# Altium schematic sheet joystickClocks.SchDoc
size A4
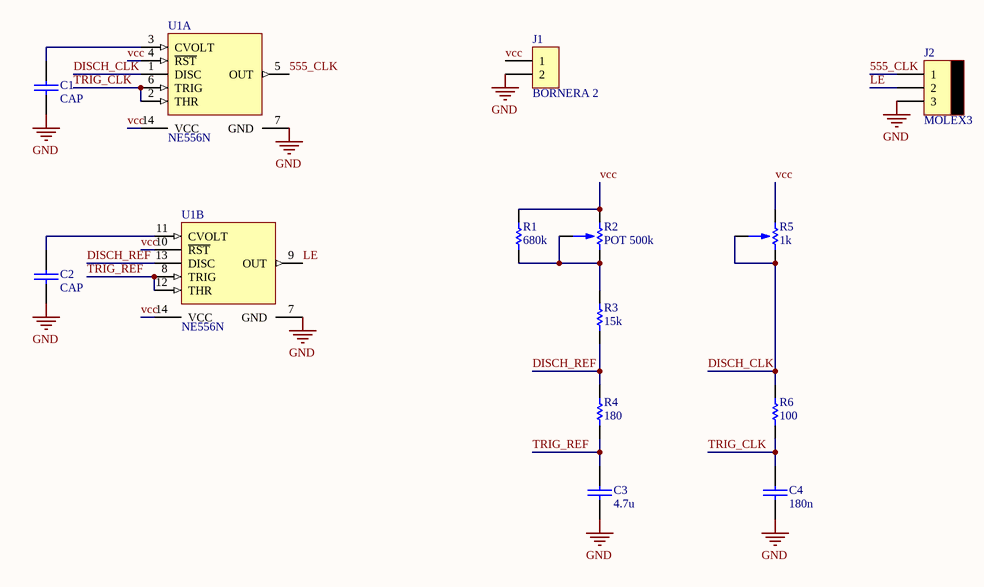
[diagram p0: joystickClocks.SchDoc]

## Parts
C1  CAP  [0805]
C2  CAP  [0805]
C3  4.7u  [0805]
C4  180n  [0805]
J1  BORNERA 2  [BORNERA2]
J2  MOLEX3  [MOLEX3]
R1  680k  [0805]
R2  POT 500k  [POTENCIOMETRO]
R3  15k  [0805]
R4  180  [RES400]
R5  1k  [PRESET V]
R6  100  [0805]
U1  NE556N  [N014]  (parts A,B of 2)

## Nets
GND: C1.2 C2.2 C3.2 C4.2 J1.2 J2.3 U1.7(GND)
555_CLK: J2.1 U1.5(OUT)
DISCH_CLK: R5.1 R5.2 R6.2 U1.1(DISC)
DISCH_REF: R3.1 R4.2 U1.13(DISC)
LE: J2.2 U1.9(OUT)
TRIG_CLK: C4.1 R6.1 U1.2(THR) U1.6(TRIG)
TRIG_REF: C3.1 R4.1 U1.8(TRIG) U1.12(THR)
vcc: J1.1 R1.2 R2.3 R5.3 U1.4(~{RST}) U1.10(~{RST}) U1.14(VCC)
NetC1_1: C1.1 U1.3(CVOLT)
NetC2_1: C2.1 U1.11(CVOLT)
NetR1_1: R1.1 R2.1 R2.2 R3.2

## Library data of the parts
C3 C4 = CAP
R1 R3 R4 R6 = RES
R2 = POTENCIOMETRO
R5 = PRESET
U1 = NE556N: Dual Precision Timer; Published: 16-Jan-2001; LatestRevisionDate: 04-Mar-2005; LatestRevisionNote: Stylized 3D Model Added.; DatasheetVersion: Dec-1999; PackageVersion: Oct-1995; PackageReference: N014; Publisher: Altium Limited; PackageDescription: DIP; 14 Leads; Row Spacing 7.62 mm; Pitch 2.54 mm; ComponentLink1Description: Manufacturer Link; ComponentLink1URL: http://www.ti.com/; ComponentLink2Description: Datasheet; ComponentLink2URL: http://www-s.ti.com/sc/ds/ne556.pdf